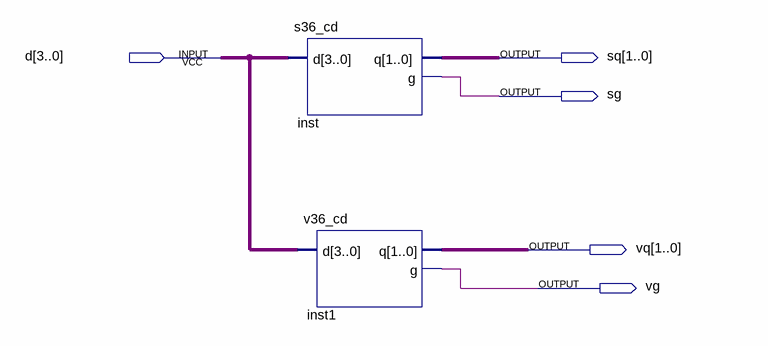
[diagram p0: schematic sheet]
// Quartus schematic sv36_cd.bdf as structural Verilog: 2 symbols, 5 pins
module sv36_cd (
  input  [3:0] d,
  output [1:0] sq,
  output sg,
  output [1:0] vq,
  output vg
);

  s36_cd inst (.d(d), .q(sq), .g(sg));
  v36_cd inst1 (.d(d), .q(vq), .g(vg));
endmodule
